# Altium schematic sheet BTL.SchDoc
size A4; SheetNumber: 1; SheetTotal: 1
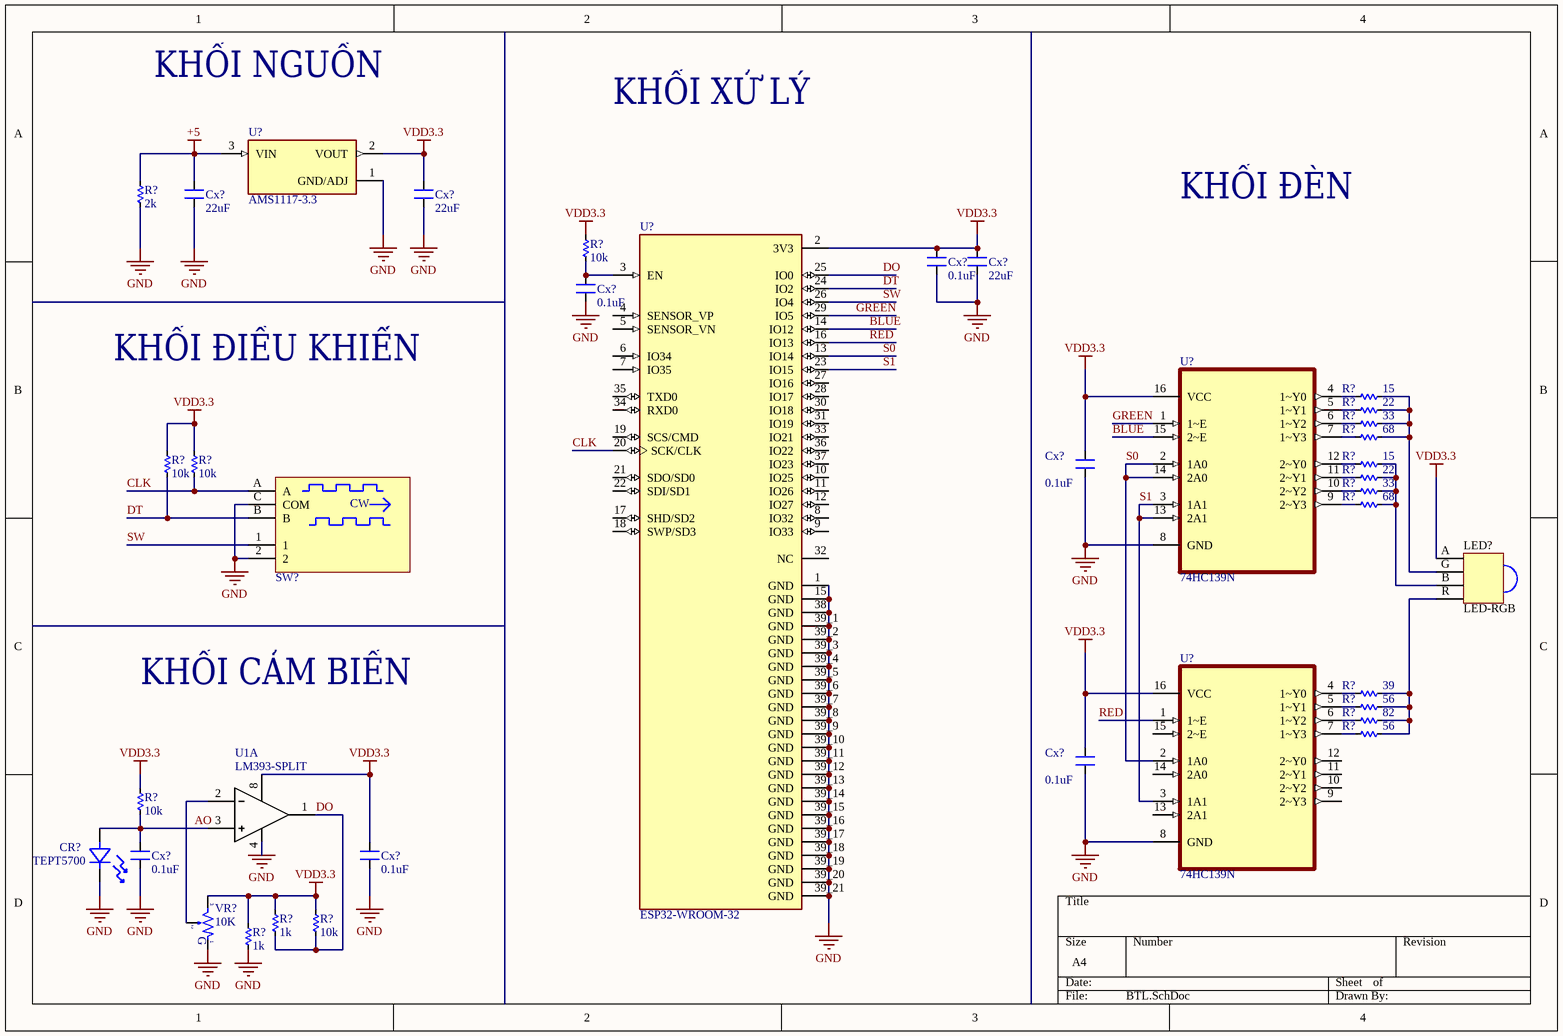
[diagram p0: BTL.SchDoc]

## Parts
(Parts that share a designator on the sheet are numbered #1, #2 ... from top to bottom, then left to right.)
CR?  TEPT5700  [LED_TEPT5700]
Cx?#1  22uF  [CN-SMD-0805]
Cx?#2  22uF  [CN-SMD-0805]
Cx?#3  0.1uF  [CN-SMD-0805]
Cx?#4  22uF  [CN-SMD-0805]
Cx?#5  0.1uF  [CN-SMD-0805]
Cx?#6  0.1uF  [CN-SMD-0805]
Cx?#7  0.1uF  [CN-SMD-0805]
Cx?#8  0.1uF  [CN-SMD-0805]
Cx?#9  0.1uF  [CN-SMD-0805]
LED?  LED-RGB  [LED-5MMRGBCA]
R?#1  2k  [RES-SMD-0805]
R?#2  10k  [RES-SMD-0805]
R?#3  15  [RES-SMD-0805]
R?#4  22  [RES-SMD-0805]
R?#5  33  [RES-SMD-0805]
R?#6  68  [RES-SMD-0805]
R?#7  10k  [RES-SMD-0805]
R?#8  10k  [RES-SMD-0805]
R?#9  15  [RES-SMD-0805]
R?#10  22  [RES-SMD-0805]
R?#11  33  [RES-SMD-0805]
R?#12  68  [RES-SMD-0805]
R?#13  39  [RES-SMD-0805]
R?#14  56  [RES-SMD-0805]
R?#15  82  [RES-SMD-0805]
R?#16  56  [RES-SMD-0805]
R?#17  10k  [RES-SMD-0805]
R?#18  1k  [RES-SMD-0805]
R?#19  10k  [RES-SMD-0805]
R?#20  1k  [RES-SMD-0805]
SW?  482020514001  [4820xx514001]  (value not drawn)
U1  LM393-SPLIT  [DIP8]  (part A of 2)
U?#1  AMS1117-3.3  [SOT229P700X180-4N]
U?#2  ESP32-WROOM-32  [MODULE_ESP32-WROOM-32]
U?#3  74HC139N  [DIP254P762X420-16]
U?#4  74HC139N  [DIP254P762X420-16]
VR?  10K  [VR-S3]

## Nets
+5: Cx?#1.2 R?#1.1 U?#1.3(VIN)
GND: CR?.1 Cx?#1.1 Cx?#2.1 Cx?#3.1 Cx?#4.1 Cx?#5.1 Cx?#6.1 Cx?#7.1 Cx?#8.1 Cx?#9.1 R?#1.2 R?#20.2 SW?.2 SW?.C(COM) U1.4(Vcc-) U?#1.1(GND/ADJ) U?#2.1(GND) U?#2.15(GND) U?#2.38(GND) U?#2.39_1(GND) U?#2.39_2(GND) U?#2.39_3(GND) U?#2.39_4(GND) U?#2.39_5(GND) U?#2.39_6(GND) U?#2.39_7(GND) U?#2.39_8(GND) U?#2.39_9(GND) U?#2.39_10(GND) U?#2.39_11(GND) U?#2.39_12(GND) U?#2.39_13(GND) U?#2.39_14(GND) U?#2.39_15(GND) U?#2.39_16(GND) U?#2.39_17(GND) U?#2.39_18(GND) U?#2.39_19(GND) U?#2.39_20(GND) U?#2.39_21(GND) U?#3.8(GND) U?#4.8(GND) VR?.1
VDD3.3: Cx?#2.2 Cx?#3.2 Cx?#4.2 Cx?#6.2 Cx?#7.2 Cx?#9.2 LED?.A R?#2.1 R?#7.1 R?#8.1 R?#17.1 R?#18.1 R?#19.1 R?#20.1 U1.8(Vcc+) U?#1.2(VOUT) U?#2.2(3V3) U?#3.16(VCC) U?#4.16(VCC) VR?.3
AO: CR?.2 Cx?#8.2 R?#17.2 U1.3
BLUE: U?#2.14(IO12) U?#3.15(2~E)
CLK: R?#8.2 SW?.A U?#2.20(SCK/CLK)
DO: R?#18.2 R?#19.2 U1.1 U?#2.25(IO0)
DT: R?#7.2 SW?.B U?#2.24(IO2)
GREEN: U?#2.29(IO5) U?#3.1(1~E)
RED: U?#2.16(IO13) U?#4.1(1~E)
S0: U?#2.13(IO14) U?#3.2(1A0) U?#3.14(2A0) U?#4.2(1A0)
S1: U?#2.23(IO15) U?#3.3(1A1) U?#3.13(2A1) U?#4.3(1A1)
SW: SW?.1 U?#2.26(IO4)
NetCx?#5_2: Cx?#5.2 R?#2.2 U?#2.3(EN)
NetLED?_B: LED?.B R?#9.1 R?#10.1 R?#11.1 R?#12.1
NetLED?_G: LED?.G R?#3.1 R?#4.1 R?#5.1 R?#6.1
NetLED?_R: LED?.R R?#13.1 R?#14.1 R?#15.1 R?#16.1
NetR?#3_2: R?#3.2 U?#3.4(1~Y0)
NetR?#4_2: R?#4.2 U?#3.5(1~Y1)
NetR?#5_2: R?#5.2 U?#3.6(1~Y2)
NetR?#6_2: R?#6.2 U?#3.7(1~Y3)
NetR?#9_2: R?#9.2 U?#3.12(2~Y0)
NetR?#10_2: R?#10.2 U?#3.11(2~Y1)
NetR?#11_2: R?#11.2 U?#3.10(2~Y2)
NetR?#12_2: R?#12.2 U?#3.9(2~Y3)
NetR?#13_2: R?#13.2 U?#4.4(1~Y0)
NetR?#14_2: R?#14.2 U?#4.5(1~Y1)
NetR?#15_2: R?#15.2 U?#4.6(1~Y2)
NetR?#16_2: R?#16.2 U?#4.7(1~Y3)
NetU1_2: U1.2 VR?.2

Not connected (* = marked no-connect by the designer): U?#2 4(SENSOR_VP) 5(SENSOR_VN) 6(IO34) 7(IO35) 8(IO32) 9(IO33) 10(IO25) 11(IO26) 12(IO27) 17(SHD/SD2) 18(SWP/SD3) 19(SCS/CMD) 21(SDO/SD0) 22(SDI/SD1) 27(IO16) 28(IO17) 30(IO18) 31(IO19) 32(NC) 33(IO21) 34(RXD0) 35(TXD0) 36(IO22) 37(IO23); U?#4 9(2~Y3) 10(2~Y2) 11(2~Y1) 12(2~Y0) 13(2A1) 14(2A0) 15(2~E)

## Notes on the sheet
- KHỐI NGUỒN
- KHỐI XỬ LÝ
- KHỐI ĐÈN
- KHỐI ĐIỀU KHIỂN
- KHỐI CẢM BIẾN
- (in symbol 482020514001) CW
- (in symbol VR-S) G

## Library data of the parts
CR? = TEPT5700: AMBIENT LIGHT SENSOR PHOTOTRANSISTOR CHIP SILICON 570NM 2-PIN T-1 3/4 | Siliconix / Vishay TEPT5700; MF: Vishay Semiconductors; SnapEDA_Link: https://www.snapeda.com/parts/TEPT5700/Vishay/view-part/?ref=snap; Package: None; Value: *; MP: TEPT5700; Check_prices: https://www.snapeda.com/parts/TEPT5700/Vishay/view-part/?ref=eda
Cx?#1-Cx?#9 = CN: Value: 33pF
R?#1-R?#20 = Res-SMD: Resistor; Manufacturer: Generic Components; Class: Passive; Published: 08/06/2000; Publisher: Altium Hobart Technology Centre
SW? = 482020514001: WS-ENTV Mechanical Incremental Encoder Switch, Metal Shaft with bushing, 20Pulse/360°, 20positions,; Manufacturer: Wurth Elektronik; Operation Force: 600g; Electrical Life Encoder: 15000Cycles; Electrical Life Switch: 20000Cycles; Insulation Resistance: 100MΩ; Rated Current: 10mA; ComponentLink1Description: Website Link; ComponentLink1URL: https://www.we-online.com/redexpert/article/482020514001?ad; ComponentLink2Description: Datasheet Link; ComponentLink2URL: https://www.we-online.com/redexpert/spec/482020514001?ad; Manufacturer Part Number: 482020514001; Category: Encoder Switches; Match Code: WS-ENTV; Mount: Through Hole; Operating Temperature Max: 85°C; Operating Temperature Min: -40°C; Packaging: Tray; Length: 13.75mm; Width: 11.7mm; Height: 26.6mm; Detent: 20positions; Resolution: 20Pulse/360°
U1 = LM393-SPLIT: IC DUAL COMPARATOR; Supplier 1: Digi-Key; Supplier Part Number 1: LM393MXFSDKR-ND
U?#1 = AMS1117-3.3: Sot223/Pkg 1-Amp 3.3-Volt Low Drop Out Voltage Regulatator; MF: Advanced Monolithic Systems; SnapEDA_Link: https://www.snapeda.com/parts/AMS1117-3.3/Advanced+Monolithic+Systems/view-part/?ref=snap; Package: SOT-223 Seeed Technology; Value: *; MP: AMS1117-3.3; Check_prices: https://www.snapeda.com/parts/AMS1117-3.3/Advanced+Monolithic+Systems/view-part/?ref=eda
U?#2 = ESP32-WROOM-32: RX TXRX MOD WIFI TRACE ANT SMD; MF: Espressif Systems; MP: ESP32WROOM32; SnapEDA_Link: https://www.snapeda.com/parts/ESP32WROOM32/Espressif+Systems/view-part/?ref=snap; Package: None; Value: *; Check_prices: https://www.snapeda.com/parts/ESP32WROOM32/Espressif+Systems/view-part/?ref=eda
U?#3 U?#4 = 74HC139N: Decoder/Demultiplexer 1 x 2:4 16-DIP; MF: NXP Semiconductors; SnapEDA_Link: https://www.snapeda.com/parts/74HC139N/NXP+Semiconductors/view-part/?ref=snap; Package: SOT38-4-16 Nexperia; Value: *; MP: 74HC139N; Check_prices: https://www.snapeda.com/parts/74HC139N/NXP+Semiconductors/view-part/?ref=eda
VR? = VR-S: Var Resistor; Value: Volume 50k